# Altium schematic sheet conn_harness_lv.SchDoc
size B
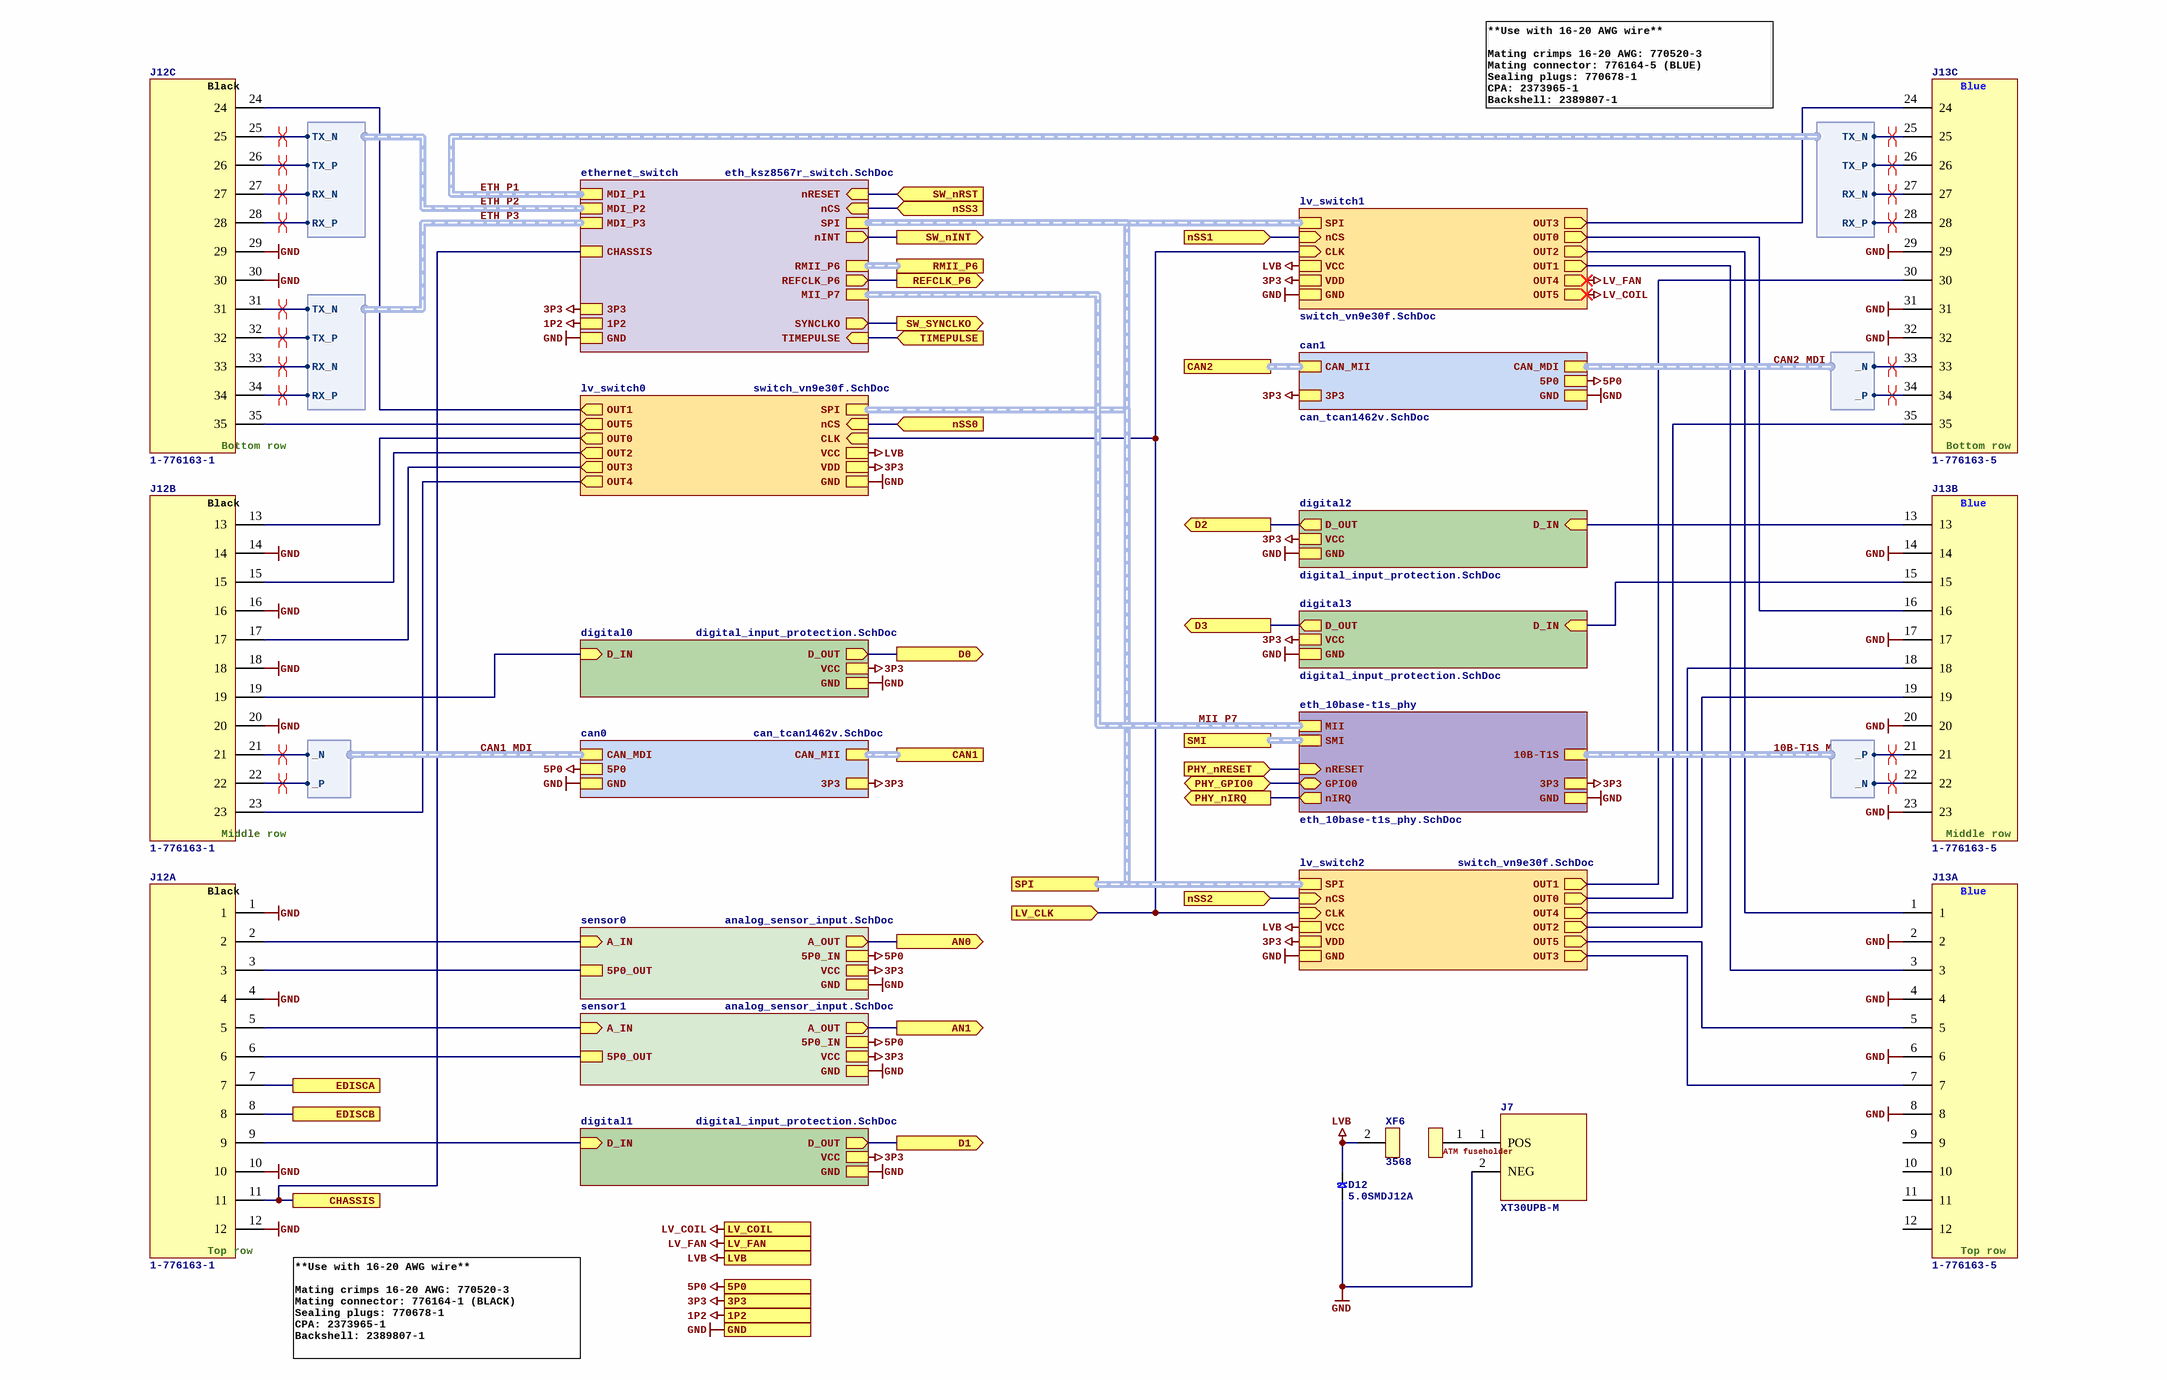
[diagram p0: conn_harness_lv.SchDoc]

## Parts
D12  5.0SMDJ12A  [SMC]
J7  XT30UPB-M  [AMASS_XT30UPB-M]
J12  1-776163-1  [TE_AMPSEAL_1-776163-1]  (parts A,B,C of 3)
J13  1-776163-5  [TE_AMPSEAL_1-776163-5]  (parts A,B,C of 3)
XF6  3568  [FUSEHOLDER_KEYSTONE_3568]

## Sub-sheets
can0 = can_tcan1462v.SchDoc: GND, 5P0, CAN_MII (harness CAN), CAN_MDI (harness DIFF), 3P3
can1 = can_tcan1462v.SchDoc: GND, 5P0, CAN_MII (harness CAN), CAN_MDI (harness DIFF), 3P3
digital0 = digital_input_protection.SchDoc: D_OUT (out), D_IN (in), GND, VCC
digital1 = digital_input_protection.SchDoc: D_OUT (out), D_IN (in), GND, VCC
digital2 = digital_input_protection.SchDoc: D_OUT (out), D_IN (in), GND, VCC
digital3 = digital_input_protection.SchDoc: D_OUT (out), D_IN (in), GND, VCC
eth_10base-t1s_phy = eth_10base-t1s_phy.SchDoc: MII (harness MII), SMI (harness SMI), nRESET (in), GND, 3P3, GPIO0 (bidir), nIRQ (out), 10B-T1S (harness DIFF)
ethernet_switch = eth_ksz8567r_switch.SchDoc: nRESET (in), MDI_P1 (harness 100BASE-TX), MDI_P2 (harness 100BASE-TX), MDI_P3 (harness 100BASE-TX), GND, 1P2, 3P3, CHASSIS, RMII_P6 (harness RMII), REFCLK_P6 (out), TIMEPULSE (in), MII_P7 (harness MII), SPI (harness SPI), nCS (in), nINT (out), SYNCLKO (out)
lv_switch0 = switch_vn9e30f.SchDoc: OUT0 (out), OUT1 (out), OUT2 (out), OUT3 (out), OUT4 (out), OUT5 (out), VCC, GND, VDD, SPI (harness SPI), nCS (in), CLK (in)
lv_switch1 = switch_vn9e30f.SchDoc: OUT0 (out), OUT1 (out), OUT2 (out), OUT3 (out), OUT4 (out), OUT5 (out), VCC, GND, VDD, SPI (harness SPI), nCS (in), CLK (in)
lv_switch2 = switch_vn9e30f.SchDoc: OUT0 (out), OUT1 (out), OUT2 (out), OUT3 (out), OUT4 (out), OUT5 (out), VCC, GND, VDD, SPI (harness SPI), nCS (in), CLK (in)
sensor0 = analog_sensor_input.SchDoc: A_OUT (out), A_IN (in), 5P0_IN, GND, 5P0_OUT, VCC
sensor1 = analog_sensor_input.SchDoc: A_OUT (out), A_IN (in), 5P0_IN, GND, 5P0_OUT, VCC

## Ports
1P2, 3P3, 5P0, AN0 (out), AN1 (out), CAN1 (harness CAN), CAN2 (harness CAN), CHASSIS, D0 (out), D1 (out), D2 (out), D3 (out), EDISCA, EDISCB, GND, LV_CLK (in), LV_COIL, LV_FAN, LVB, nSS0 (in), nSS1 (in), nSS2 (in), nSS3 (in), PHY_GPIO0 (bidir), PHY_nIRQ (out), PHY_nRESET (in), REFCLK_P6 (out), RMII_P6 (harness RMII), SMI (harness SMI), SPI (harness SPI), SW_nINT (out), SW_nRST (in), SW_SYNCLKO (out), TIMEPULSE (in)

## Harnesses
DIFF: _P, _N
100BASE-TX: TX_N, TX_P, RX_N, RX_P

## Nets
1P2: port 1P2, sheet ethernet_switch/1P2
3P3: port 3P3, sheet can1/3P3, sheet can0/3P3, sheet ethernet_switch/3P3, sheet lv_switch0/VDD, sheet lv_switch1/VDD, sheet lv_switch2/VDD, sheet sensor0/VCC, sheet sensor1/VCC, sheet digital0/VCC, sheet digital1/VCC, sheet digital2/VCC, sheet digital3/VCC, sheet eth_10base-t1s_phy/3P3
5P0: port 5P0, sheet can1/5P0, sheet can0/5P0, sheet sensor0/5P0_IN, sheet sensor1/5P0_IN
GND: D12.1 J7.2(NEG) J12.1 J12.4 J12.10 J12.12 J12.14 J12.16 J12.18 J12.20 J12.29 J12.30 J13.2 J13.4 J13.6 J13.8 J13.14 J13.17 J13.20 J13.23 J13.29 J13.31 J13.32 ; port GND, sheet can1/GND, sheet can0/GND, sheet ethernet_switch/GND, sheet lv_switch0/GND, sheet lv_switch1/GND, sheet lv_switch2/GND, sheet sensor0/GND, sheet sensor1/GND, sheet digital0/GND, sheet digital1/GND, sheet digital2/GND, sheet digital3/GND, sheet eth_10base-t1s_phy/GND
LV_COIL: port LV_COIL, sheet lv_switch1/OUT5
LV_FAN: port LV_FAN, sheet lv_switch1/OUT4
LVB: D12.2 XF6.2 ; port LVB, sheet lv_switch0/VCC, sheet lv_switch1/VCC, sheet lv_switch2/VCC
10B-T1S_MDI._N: J13.22 ; sheet eth_10base-t1s_phy/10B-T1S._N
10B-T1S_MDI._P: J13.21 ; sheet eth_10base-t1s_phy/10B-T1S._P
AN0: port AN0, sheet sensor0/A_OUT
AN1: port AN1, sheet sensor1/A_OUT
CAN1_MDI._N: J12.21 ; sheet can0/CAN_MDI._N
CAN1_MDI._P: J12.22 ; sheet can0/CAN_MDI._P
CAN2_MDI._N: J13.33 ; sheet can1/CAN_MDI._N
CAN2_MDI._P: J13.34 ; sheet can1/CAN_MDI._P
CHASSIS: J12.11 ; port CHASSIS, sheet ethernet_switch/CHASSIS
D0: port D0, sheet digital0/D_OUT
D1: port D1, sheet digital1/D_OUT
D2: port D2, sheet digital2/D_OUT
D3: port D3, sheet digital3/D_OUT
EDISCA: J12.7 ; port EDISCA
EDISCB: J12.8 ; port EDISCB
ETH_P1.RX_N: J13.27 ; sheet ethernet_switch/MDI_P1.RX_N
ETH_P1.RX_P: J13.28 ; sheet ethernet_switch/MDI_P1.RX_P
ETH_P1.TX_N: J13.25 ; sheet ethernet_switch/MDI_P1.TX_N
ETH_P1.TX_P: J13.26 ; sheet ethernet_switch/MDI_P1.TX_P
ETH_P2.RX_N: J12.27 ; sheet ethernet_switch/MDI_P2.RX_N
ETH_P2.RX_P: J12.28 ; sheet ethernet_switch/MDI_P2.RX_P
ETH_P2.TX_N: J12.25 ; sheet ethernet_switch/MDI_P2.TX_N
ETH_P2.TX_P: J12.26 ; sheet ethernet_switch/MDI_P2.TX_P
ETH_P3.RX_N: J12.33 ; sheet ethernet_switch/MDI_P3.RX_N
ETH_P3.RX_P: J12.34 ; sheet ethernet_switch/MDI_P3.RX_P
ETH_P3.TX_N: J12.31 ; sheet ethernet_switch/MDI_P3.TX_N
ETH_P3.TX_P: J12.32 ; sheet ethernet_switch/MDI_P3.TX_P
LV_CLK: port LV_CLK, sheet lv_switch0/CLK, sheet lv_switch1/CLK, sheet lv_switch2/CLK
nSS0: port nSS0, sheet lv_switch0/nCS
nSS1: port nSS1, sheet lv_switch1/nCS
nSS2: port nSS2, sheet lv_switch2/nCS
nSS3: port nSS3, sheet ethernet_switch/nCS
PHY_GPIO0: port PHY_GPIO0, sheet eth_10base-t1s_phy/GPIO0
PHY_nIRQ: port PHY_nIRQ, sheet eth_10base-t1s_phy/nIRQ
PHY_nRESET: port PHY_nRESET, sheet eth_10base-t1s_phy/nRESET
REFCLK_P6: port REFCLK_P6, sheet ethernet_switch/REFCLK_P6
SW_nINT: port SW_nINT, sheet ethernet_switch/nINT
SW_nRST: port SW_nRST, sheet ethernet_switch/nRESET
SW_SYNCLKO: port SW_SYNCLKO, sheet ethernet_switch/SYNCLKO
TIMEPULSE: port TIMEPULSE, sheet ethernet_switch/TIMEPULSE
NetJ7_1: J7.1(POS) XF6.1
NetJ12_2: J12.2 ; sheet sensor0/A_IN
NetJ12_3: J12.3 ; sheet sensor0/5P0_OUT
NetJ12_5: J12.5 ; sheet sensor1/A_IN
NetJ12_6: J12.6 ; sheet sensor1/5P0_OUT
NetJ12_9: J12.9 ; sheet digital1/D_IN
NetJ12_13: J12.13 ; sheet lv_switch0/OUT0
NetJ12_15: J12.15 ; sheet lv_switch0/OUT2
NetJ12_17: J12.17 ; sheet lv_switch0/OUT3
NetJ12_19: J12.19 ; sheet digital0/D_IN
NetJ12_23: J12.23 ; sheet lv_switch0/OUT4
NetJ12_24: J12.24 ; sheet lv_switch0/OUT1
NetJ12_35: J12.35 ; sheet lv_switch0/OUT5
NetJ13_1: J13.1 ; sheet lv_switch1/OUT2
NetJ13_3: J13.3 ; sheet lv_switch1/OUT1
NetJ13_5: J13.5 ; sheet lv_switch2/OUT5
NetJ13_7: J13.7 ; sheet lv_switch2/OUT3
NetJ13_13: J13.13 ; sheet digital2/D_IN
NetJ13_15: J13.15 ; sheet digital3/D_IN
NetJ13_16: J13.16 ; sheet lv_switch1/OUT0
NetJ13_18: J13.18 ; sheet lv_switch2/OUT4
NetJ13_19: J13.19 ; sheet lv_switch2/OUT2
NetJ13_24: J13.24 ; sheet lv_switch1/OUT3
NetJ13_30: J13.30 ; sheet lv_switch2/OUT1
NetJ13_35: J13.35 ; sheet lv_switch2/OUT0

Not connected (* = marked no-connect by the designer): J13 9 10 11 12

## Buses and harness runs
harness 10B-T1S_MDI = sheet eth_10base-t1s_phy/10B-T1S
harness CAN1_MDI = sheet can0/CAN_MDI
harness CAN2_MDI = sheet can1/CAN_MDI
harness ETH_P1 = sheet ethernet_switch/MDI_P1
harness ETH_P2 = sheet ethernet_switch/MDI_P2
harness ETH_P3 = sheet ethernet_switch/MDI_P3
harness MII_P7 = sheet eth_10base-t1s_phy/MII = sheet ethernet_switch/MII_P7
harness port CAN1 = sheet can0/CAN_MII
harness port CAN2 = sheet can1/CAN_MII
harness port RMII_P6 = sheet ethernet_switch/RMII_P6
harness port SMI = sheet eth_10base-t1s_phy/SMI
harness port SPI = sheet ethernet_switch/SPI = sheet lv_switch0/SPI = sheet lv_switch1/SPI = sheet lv_switch2/SPI

## Layout directives
differential pair; differential pair class DE_120: CAN1_MDI._N, CAN1_MDI._P, CAN2_MDI._N, CAN2_MDI._P
differential pair; differential pair class DE_100: 10B-T1S_MDI._N, 10B-T1S_MDI._P, ETH_P1.RX_N, ETH_P1.RX_P, ETH_P1.TX_N, ETH_P1.TX_P, ETH_P2.RX_N, ETH_P2.RX_P, ETH_P2.TX_N, ETH_P2.TX_P, ETH_P3.RX_N, ETH_P3.RX_P, ETH_P3.TX_N, ETH_P3.TX_P

## Notes on the sheet
- **Use with 16-20 AWG wire**
  Mating crimps 16-20 AWG: 770520-3
  Mating connector: 776164-5 (BLUE)
  Sealing plugs: 770678-1
  CPA: 2373965-1
  Backshell: 2389807-1
- **Use with 16-20 AWG wire**
  Mating crimps 16-20 AWG: 770520-3
  Mating connector: 776164-1 (BLACK)
  Sealing plugs: 770678-1
  CPA: 2373965-1
  Backshell: 2389807-1
- (in symbol CONN_AMPSEAL_35POS_RA_1-776163-1, part A) Black; Top row
- (in symbol CONN_AMPSEAL_35POS_RA_1-776163-1, part B) Black; Middle row
- (in symbol CONN_AMPSEAL_35POS_RA_1-776163-1, part C) Black; Bottom row
- (in symbol CONN_AMPSEAL_35POS_RA_1-776163-5, part A) Blue; Top row
- (in symbol CONN_AMPSEAL_35POS_RA_1-776163-5, part B) Blue; Middle row
- (in symbol CONN_AMPSEAL_35POS_RA_1-776163-5, part C) Blue; Bottom row
- (in symbol FUSEHOLDER_KEYSTONE_3568) ATM fuseholder

## Library data of the parts
D12 = TVS_UNI_5.0SMDJ12A: TVS 5000W 12V UNIDIRECT SMCJ; Manufacturer: Littelfuse; ComponentLink1URL: https://www.littelfuse.com/media?resourcetype=datasheets&itemid=2b2f4a8c-2e81-4894-8d41-3d748bb79e68&filename=littelfuse-tvs-diode-5-0smdj-datasheet; ComponentLink1Description: Datasheet; Supplier 1: Digikey; Supplier Part Number 1: 5.0SMDJ12ACT-ND; Manufacturer Part Number: 5.0SMDJ12A; Supplier 2: LCSC; Supplier Part Number 2: C126819
J7 = CONN_AMASS_2POS_VERT_XT30UPB-M: Vertical PCB mount XT30 male; Manufacturer: Changzhou Amass Elec; Supplier 1: LCSC; Supplier Part Number 1: C428721; Manufacturer Part Number: XT30UPB-M; ComponentLink1Description: Datasheet; ComponentLink1URL: https://www.tme.com/Document/1191bc2fa3aee3c446e5a895fd8f7983/XT60PW-F.pdf
J12 = CONN_AMPSEAL_35POS_RA_1-776163-1: Conn Power PL 35 POS 4mm Solder RA Thru-Hole 35 Terminal 1 Port, BLACK; Manufacturer: TE Connectivity; Supplier 1: Digikey; Supplier Part Number 1: A106383-ND; Manufacturer Part Number: 1-776163-1; ComponentLink1Description: Product page; ComponentLink1URL: https://www.te.com/en/product-1-776163-1.html; ComponentLink2Description: Drawing; ComponentLink2URL: https://www.te.com/commerce/DocumentDelivery/DDEController?Action=showdoc&DocId=Customer+Drawing%7F776163%7FK%7Fpdf%7FEnglish%7FENG_CD_776163_K.pdf%7F1-776163-1; ComponentLink3Description: Application specification; ComponentLink3URL: https://www.te.com/commerce/DocumentDelivery/DDEController?Action=showdoc&DocId=Specification+Or+Standard%7F114-16016%7FR1%7Fpdf%7FEnglish%7FENG_SS_114-16016_R1.pdf%7F1-776163-1; Supplier 2: LCSC; Supplier Part Number 2: C596198; ComponentLink4Description: Series catalog; ComponentLink4URL: https://www.te.com/commerce/DocumentDelivery/DDEController?Action=showdoc&DocId=Data+Sheet%7F1-1773979-2%7FA%7Fpdf%7FEnglish%7FENG_DS_1-1773979-2_A.pdf%7F1-776280-1; ComponentLink5Description: Product specification; ComponentLink5URL: https://www.te.com/commerce/DocumentDelivery/DDEController?Action=showdoc&DocId=Specification+Or+Standard%7F108-1329%7FE1%7Fpdf%7FEnglish%7FENG_SS_108-1329_E1.pdf%7F1-776163-1
J13 = CONN_AMPSEAL_35POS_RA_1-776163-5: Conn Power PL 35 POS 4mm Solder RA Thru-Hole 35 Terminal 1 Port, BLUE; Manufacturer: TE Connectivity; Supplier 1: Digikey; Supplier Part Number 1: 1-776163-5-ND; Manufacturer Part Number: 1-776163-5; ComponentLink1Description: Product page; ComponentLink1URL: https://www.te.com/en/product-1-776163-5.html; ComponentLink2Description: Drawing; ComponentLink2URL: https://www.te.com/commerce/DocumentDelivery/DDEController?Action=showdoc&DocId=Customer+Drawing%7F776163%7FK%7Fpdf%7FEnglish%7FENG_CD_776163_K.pdf%7F1-776163-5; ComponentLink3Description: Application specification; ComponentLink3URL: https://www.te.com/commerce/DocumentDelivery/DDEController?Action=showdoc&DocId=Specification+Or+Standard%7F114-16016%7FR1%7Fpdf%7FEnglish%7FENG_SS_114-16016_R1.pdf%7F1-776163-5; Supplier 2: LCSC; Supplier Part Number 2: C17378321; ComponentLink4Description: Series catalog; ComponentLink4URL: https://www.te.com/commerce/DocumentDelivery/DDEController?Action=showdoc&DocId=Data+Sheet%7F1-1773979-2%7FA%7Fpdf%7FEnglish%7FENG_DS_1-1773979-2_A.pdf%7F1-776163-5; ComponentLink5Description: Product specification; ComponentLink5URL: https://www.te.com/commerce/DocumentDelivery/DDEController?Action=showdoc&DocId=Specification+Or+Standard%7F108-1329%7FE1%7Fpdf%7FEnglish%7FENG_SS_108-1329_E1.pdf%7F1-776163-5
XF6 = FUSEHOLDER_KEYSTONE_3568: Fuse Holder 30 A 500V 1 Circuit Blade Through Hole; Manufacturer: Keystone Electronics; Supplier 1: Digikey; Supplier Part Number 1: 36-3568-ND; Manufacturer Part Number: 3568; ComponentLink1URL: https://www.keyelco.com/userAssets/file/M65p42.pdf; ComponentLink1Description: Datasheet; Supplier 2: LCSC; Supplier Part Number 2: C3206956